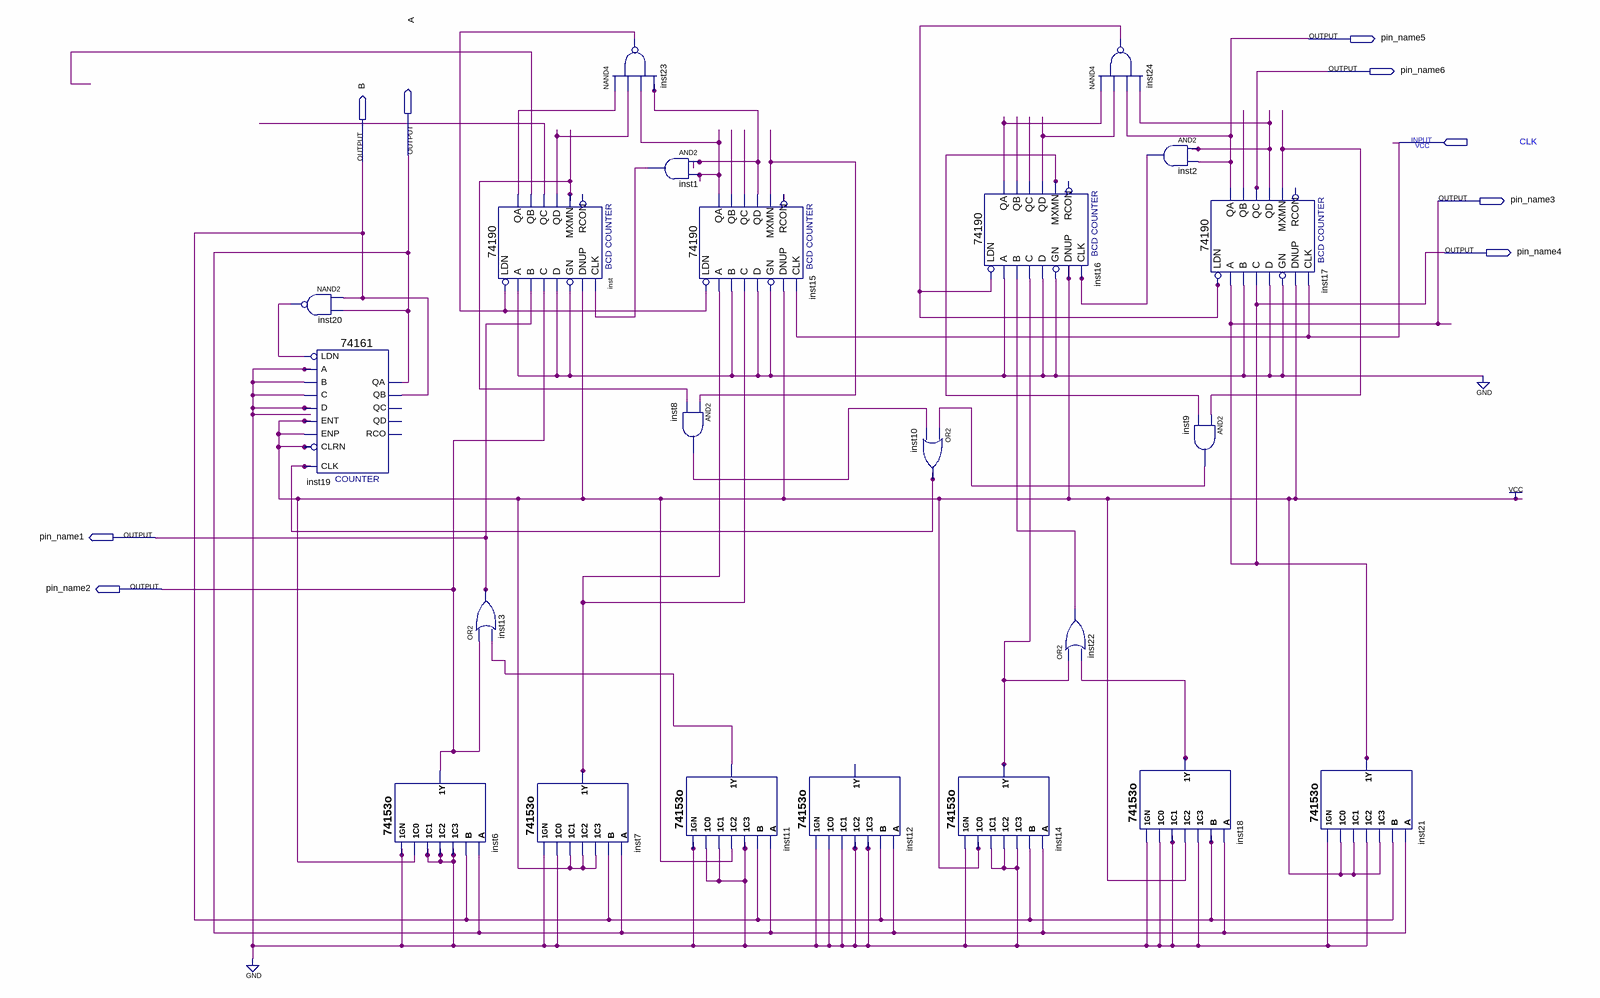
[diagram p0: schematic sheet]
// Quartus schematic Cross_fina.bdf as structural Verilog: 22 symbols, 9 pins
module Cross_fina (
  input  CLK,
  output pin_name5,
  output pin_name6,
  output A,
  output B,
  output pin_name3,
  output pin_name4,
  output pin_name1,
  output pin_name2
);

  wire inst1_out, inst2_out, inst7_1y, inst8_out, inst9_out, inst10_out, inst11_1y, inst14_1y, inst15_mxmn,
       inst15_qa, inst15_qb, inst15_qc, inst15_qd, inst15_rcon, inst16_mxmn, inst16_qa, inst16_qb, inst16_qc,
       inst16_qd, inst17_mxmn, inst17_qb, inst17_qd, inst17_rcon, inst18_1y, inst20_out, inst22_out,
       inst23_out, inst24_out, inst_mxmn, inst_qa, inst_qb, inst_qc, inst_qd;

  nand inst20 (inst20_out, B, A);
  \74161  inst19 (
    .CLRN(1'b1), .CLK(inst10_out), .ENP(1'b1), .LDN(inst20_out), .A(1'b0), .D(1'b0), .ENT(1'b1), .B(1'b0),
    .C(1'b0), .QB(B), .QA(A));  // open: QD, QC, RCO
  \74153o  inst6 (.\1C3 (1'b0), .\1GN (1'b0), .\1C1 (1'b0), .\1C0 (1'b1), .\1C2 (1'b0), .A(A), .B(B), .\1Y (pin_name2));
  or inst13 (pin_name1, pin_name2, inst11_1y);
  \74190  inst (
    .LDN(inst23_out), .A(1'b0), .C(pin_name2), .B(pin_name1), .D(1'b0), .GN(1'b0), .CLK(inst1_out),
    .DNUP(1'b1), .QA(inst_qa), .QB(inst_qb), .QD(inst_qd), .QC(inst_qc), .MXMN(inst_mxmn));  // open: RCON
  \74153o  inst7 (.\1C3 (1'b1), .\1GN (1'b0), .\1C1 (1'b1), .\1C0 (1'b0), .\1C2 (1'b1), .A(A), .B(B), .\1Y (inst7_1y));
  nand inst23 (inst23_out, inst_qa, inst_qd, inst15_qa, inst15_qd);
  and inst1 (inst1_out, inst15_qd, inst15_qa);
  \74190  inst15 (
    .LDN(inst23_out), .A(inst7_1y), .C(inst7_1y), .B(1'b0), .D(1'b0), .GN(1'b0), .CLK(CLK), .DNUP(1'b1),
    .QA(inst15_qa), .QB(inst15_qb), .QD(inst15_qd), .QC(inst15_qc), .MXMN(inst15_mxmn), .RCON(inst15_rcon));
  and inst8 (inst8_out, inst15_mxmn, inst_mxmn);
  \74153o  inst11 (
    .\1C3 (1'b0), .\1GN (1'b0), .\1C1 (1'b0), .\1C0 (1'b0), .\1C2 (1'b1), .A(A), .B(B), .\1Y (inst11_1y));
  \74153o  inst12 (.\1C3 (1'b0), .\1GN (1'b0), .\1C1 (1'b0), .\1C0 (1'b0), .\1C2 (1'b0), .A(A), .B(B));  // open: 1Y
  or inst10 (inst10_out, inst9_out, inst8_out);
  \74153o  inst14 (
    .\1C3 (1'b0), .\1GN (1'b0), .\1C1 (1'b0), .\1C0 (1'b1), .\1C2 (1'b0), .A(A), .B(B), .\1Y (inst14_1y));
  \74190  inst16 (
    .LDN(inst24_out), .A(1'b0), .C(inst14_1y), .B(inst22_out), .D(1'b0), .GN(1'b0), .CLK(inst2_out),
    .DNUP(1'b1), .QA(inst16_qa), .QB(inst16_qb), .QD(inst16_qd), .QC(inst16_qc), .MXMN(inst16_mxmn));  // open: RCON
  nand inst24 (inst24_out, inst16_qa, inst16_qd, pin_name5, inst17_qd);
  or inst22 (inst22_out, inst14_1y, inst18_1y);
  and inst2 (inst2_out, inst17_qd, pin_name5);
  \74153o  inst18 (
    .\1C3 (1'b0), .\1GN (1'b0), .\1C1 (1'b0), .\1C0 (1'b0), .\1C2 (1'b1), .A(A), .B(B), .\1Y (inst18_1y));
  \74190  inst17 (
    .LDN(inst24_out), .A(pin_name3), .C(pin_name3), .B(1'b0), .D(1'b0), .GN(1'b0), .CLK(CLK), .DNUP(1'b1),
    .QA(pin_name5), .QB(inst17_qb), .QD(inst17_qd), .QC(pin_name6), .MXMN(inst17_mxmn), .RCON(inst17_rcon));
  and inst9 (inst9_out, inst17_mxmn, inst16_mxmn);
  \74153o  inst21 (
    .\1C3 (1'b1), .\1GN (1'b0), .\1C1 (1'b1), .\1C0 (1'b1), .\1C2 (1'b0), .A(A), .B(B), .\1Y (pin_name3));

  assign pin_name4 = pin_name3;
endmodule
